# EAGLE schematic axiom_beta_imu_cso_v0.1_r1.1 (EAGLE 7.7.0)
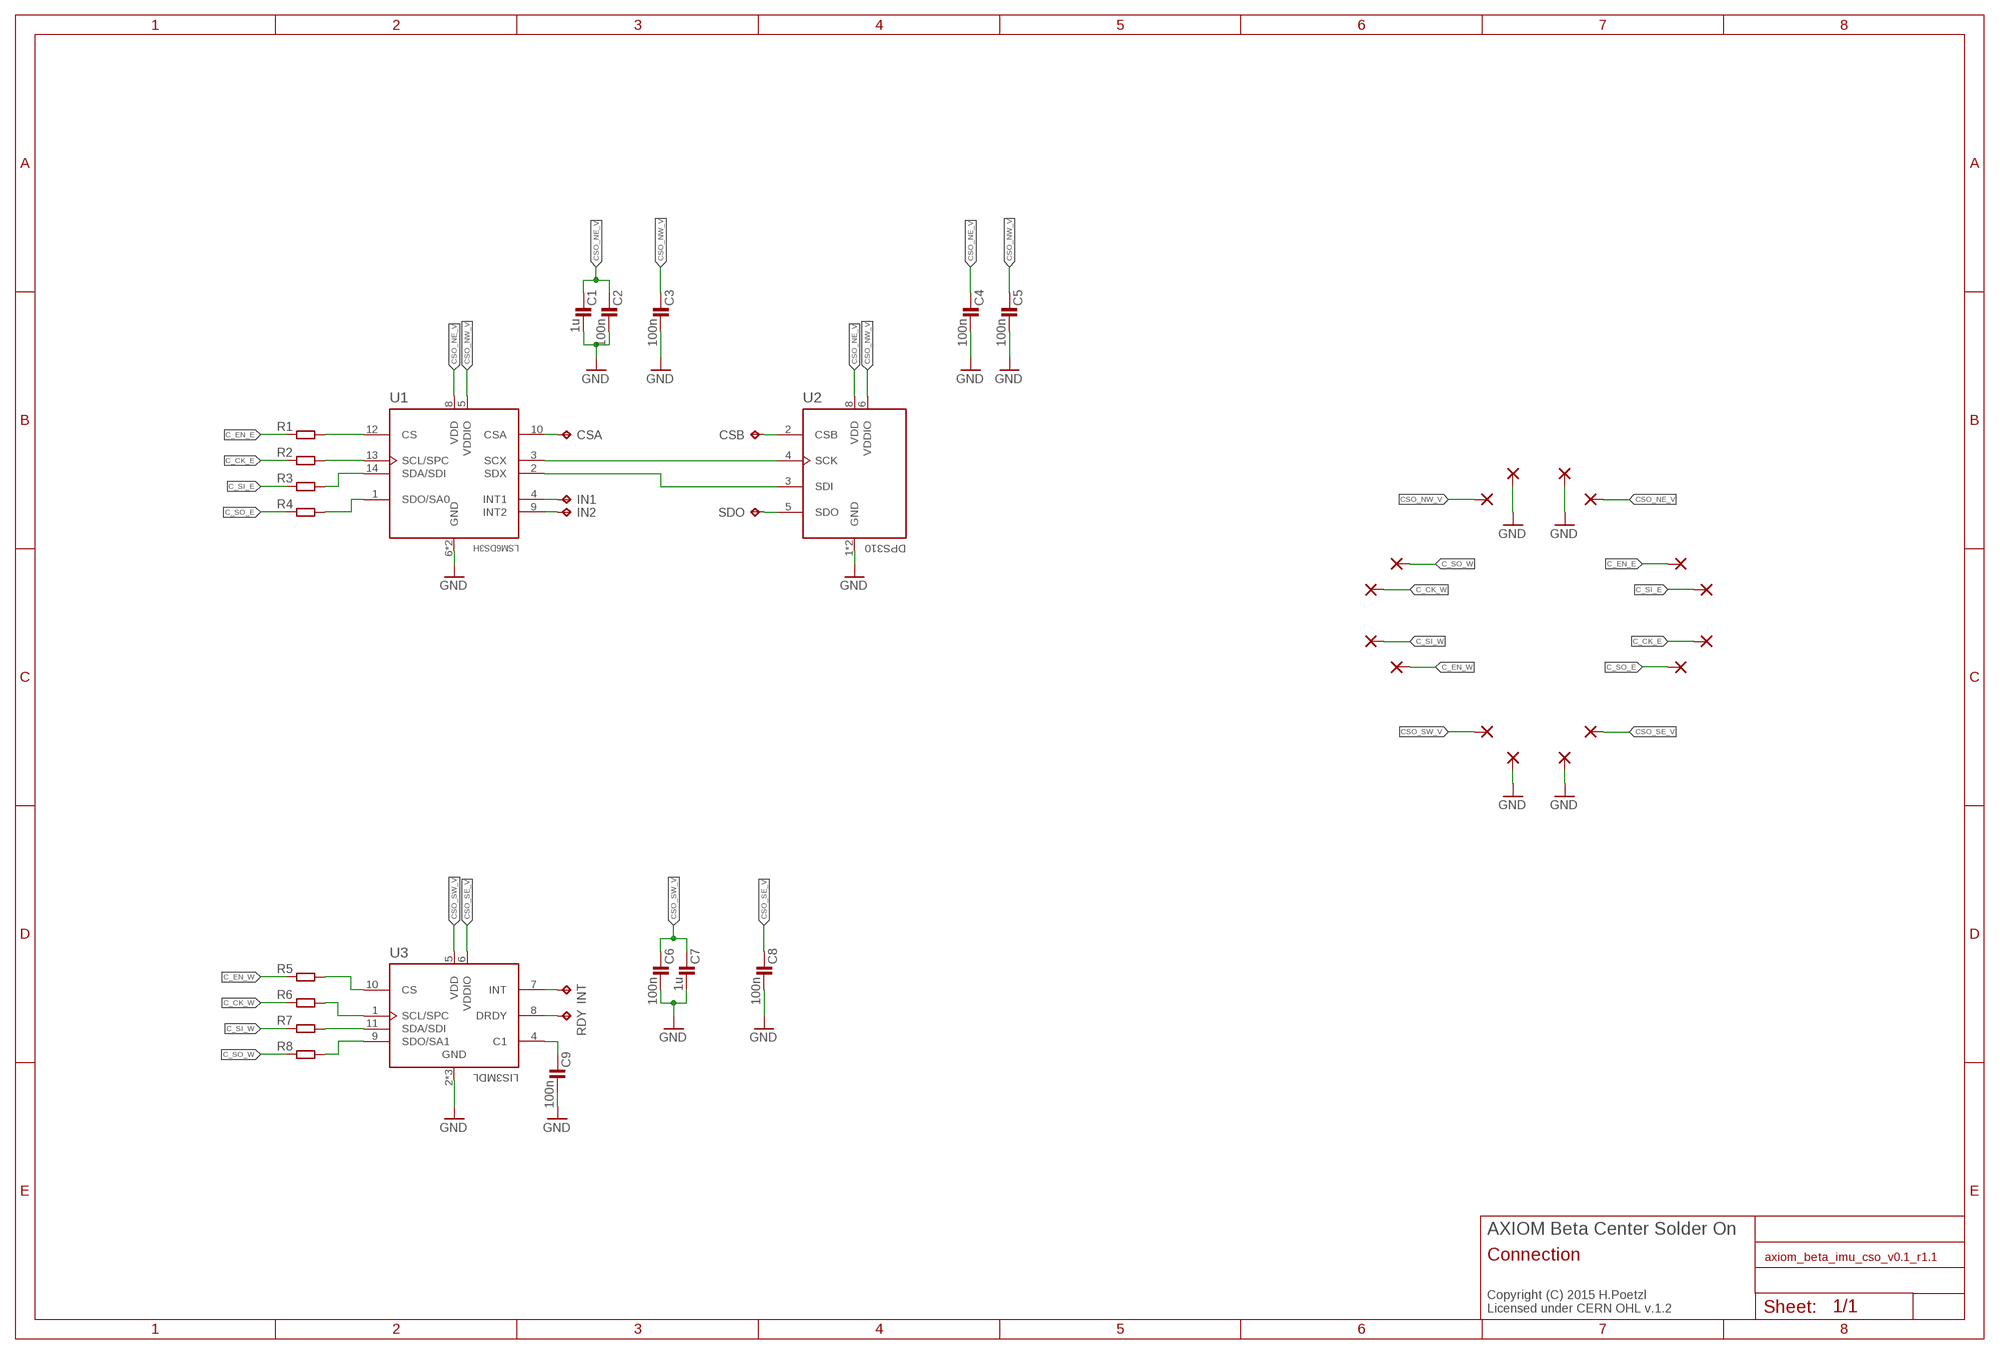
[diagram p0: schematic, sheet 1]

## Parts
C1  1u  C0402-C  [0402-C]
C2  100n  C0402-C  [0402-C]
C3  100n  C0402-C  [0402-C]
C4  100n  C0402-C  [0402-C]
C5  100n  C0402-C  [0402-C]
C6  100n  C0402-C  [0402-C]
C7  1u  C0402-C  [0402-C]
C8  100n  C0402-C  [0402-C]
C9  100n  C0402-C  [0402-C]
CSA  TPTP06R  [TP06R]
CSB  TPTP06R  [TP06R]
IN1  TPTP06R  [TP06R]
IN2  TPTP06R  [TP06R]
INT  TPTP06R  [TP06R]
R1  R0402-C  [0402-C]
R2  R0402-C  [0402-C]
R3  R0402-C  [0402-C]
R4  R0402-C  [0402-C]
R5  R0402-C  [0402-C]
R6  R0402-C  [0402-C]
R7  R0402-C  [0402-C]
R8  R0402-C  [0402-C]
RDY  TPTP06R  [TP06R]
SDO  TPTP06R  [TP06R]
U1  LSM6DS3H  [LGA-14L]
U2  DPS310  [VLGA-8]
U3  LIS3MDL  [VFLGA-12]
U$1  PINPAD2.00MM  [1.4/0.8]
U$2  PINPAD2.00MM  [1.4/0.8]
U$3  PINPAD2.00MM  [1.4/0.8]
U$4  PINPAD2.00MM  [1.4/0.8]
U$5  PINPAD2.00MM  [1.4/0.8]
U$6  PINPAD2.00MM  [1.4/0.8]
U$7  PINPAD2.00MM  [1.4/0.8]
U$8  PINPAD2.00MM  [1.4/0.8]
U$9  PINPAD2.00MM  [1.4/0.8]
U$10  PINPAD2.00MM  [1.4/0.8]
U$11  PINPAD2.00MM  [1.4/0.8]
U$12  PINPAD2.00MM  [1.4/0.8]
U$13  PINPAD2.00MM  [1.4/0.8]
U$14  PINPAD2.00MM  [1.4/0.8]
U$15  PINPAD2.00MM  [1.4/0.8]
U$16  PINPAD2.00MM  [1.4/0.8]

## Nets
C_CK_E: R2.1 U$10.1(P)
C_CK_W: R6.1 U$7.1(P)
C_EN_E: R1.1 U$6.1(P)
C_EN_W: R5.1 U$11.1(P)
C_SI_E: R3.1 U$8.1(P)
C_SI_W: R7.1 U$9.1(P)
C_SO_E: R4.1 U$12.1(P)
C_SO_W: R8.1 U$5.1(P)
CSO_NE_V [power]: C1.1 C2.1 C4.1 U1.8(VDD) U2.8(VDD) U$4.1(P)
CSO_NW_V: C3.1 C5.1 U1.5(VDDIO) U2.6(VDDIO) U$3.1(P)
CSO_SE_V: C8.1 U3.6(VDDIO) U$14.1(P)
CSO_SW_V [power]: C6.1 C7.1 U3.5(VDD) U$13.1(P)
GND: C1.2 C2.2 C3.2 C4.2 C5.2 C6.2 C7.2 C8.2 C9.2 U1.6(GND) U1.7(GND) U2.1(GND) U2.7(GND) U3.2(GND) U3.3(GND) U3.12(GND) U$1.1(P) U$2.1(P) U$15.1(P) U$16.1(P)
N$5: U1.3(SCX) U2.4(SCK)
N$6: U1.2(SDX) U2.3(SDI)
N$7: IN2.TP U1.9(INT2)
N$8: CSA.TP U1.10(CSA)
N$9: IN1.TP U1.4(INT1)
N$10: SDO.TP U2.5(SDO)
N$11: CSB.TP U2.2(CSB)
N$12: INT.TP U3.7(INT)
N$13: RDY.TP U3.8(DRDY)
N$18: C9.1 U3.4(C1)
N_CS: R1.2 U1.12(CS)
N_SDI: R3.2 U1.14(SDA/SDI)
N_SDO: R4.2 U1.1(SDO/SA0)
N_SPC: R2.2 U1.13(SCL/SPC)
S_CS: R5.2 U3.10(CS)
S_SDI: R7.2 U3.11(SDA/SDI)
S_SDO: R8.2 U3.9(SDO/SA1)
S_SPC: R6.2 U3.1(SCL/SPC)

## Notes on the sheet
- AXIOM Beta Center Solder On
- Connection
- Copyright (C) 2015 H.Poetzl
  Licensed under CERN OHL v.1.2

## Library data of the parts
C1-C9 = generic-rcl:C
CSA CSB IN1 IN2 INT RDY SDO = testpad:TP: Test pad
R1-R8 = generic-rcl:R
U1 = iNEMO:LSM6DS3H
U2 = dps310:DPS310
U3 = lis3mdl:LIS3MDL
U$1-U$16 = pinpad:PINPAD

## Net classes
0 default: width 0.152 mm, drill 0.254 mm
1 power: width 0.152 mm, drill 0.254 mm